# EAGLE design PCB-BI8-2x1RGB (EAGLE 7.5.0)

## Sheet 1 of 2
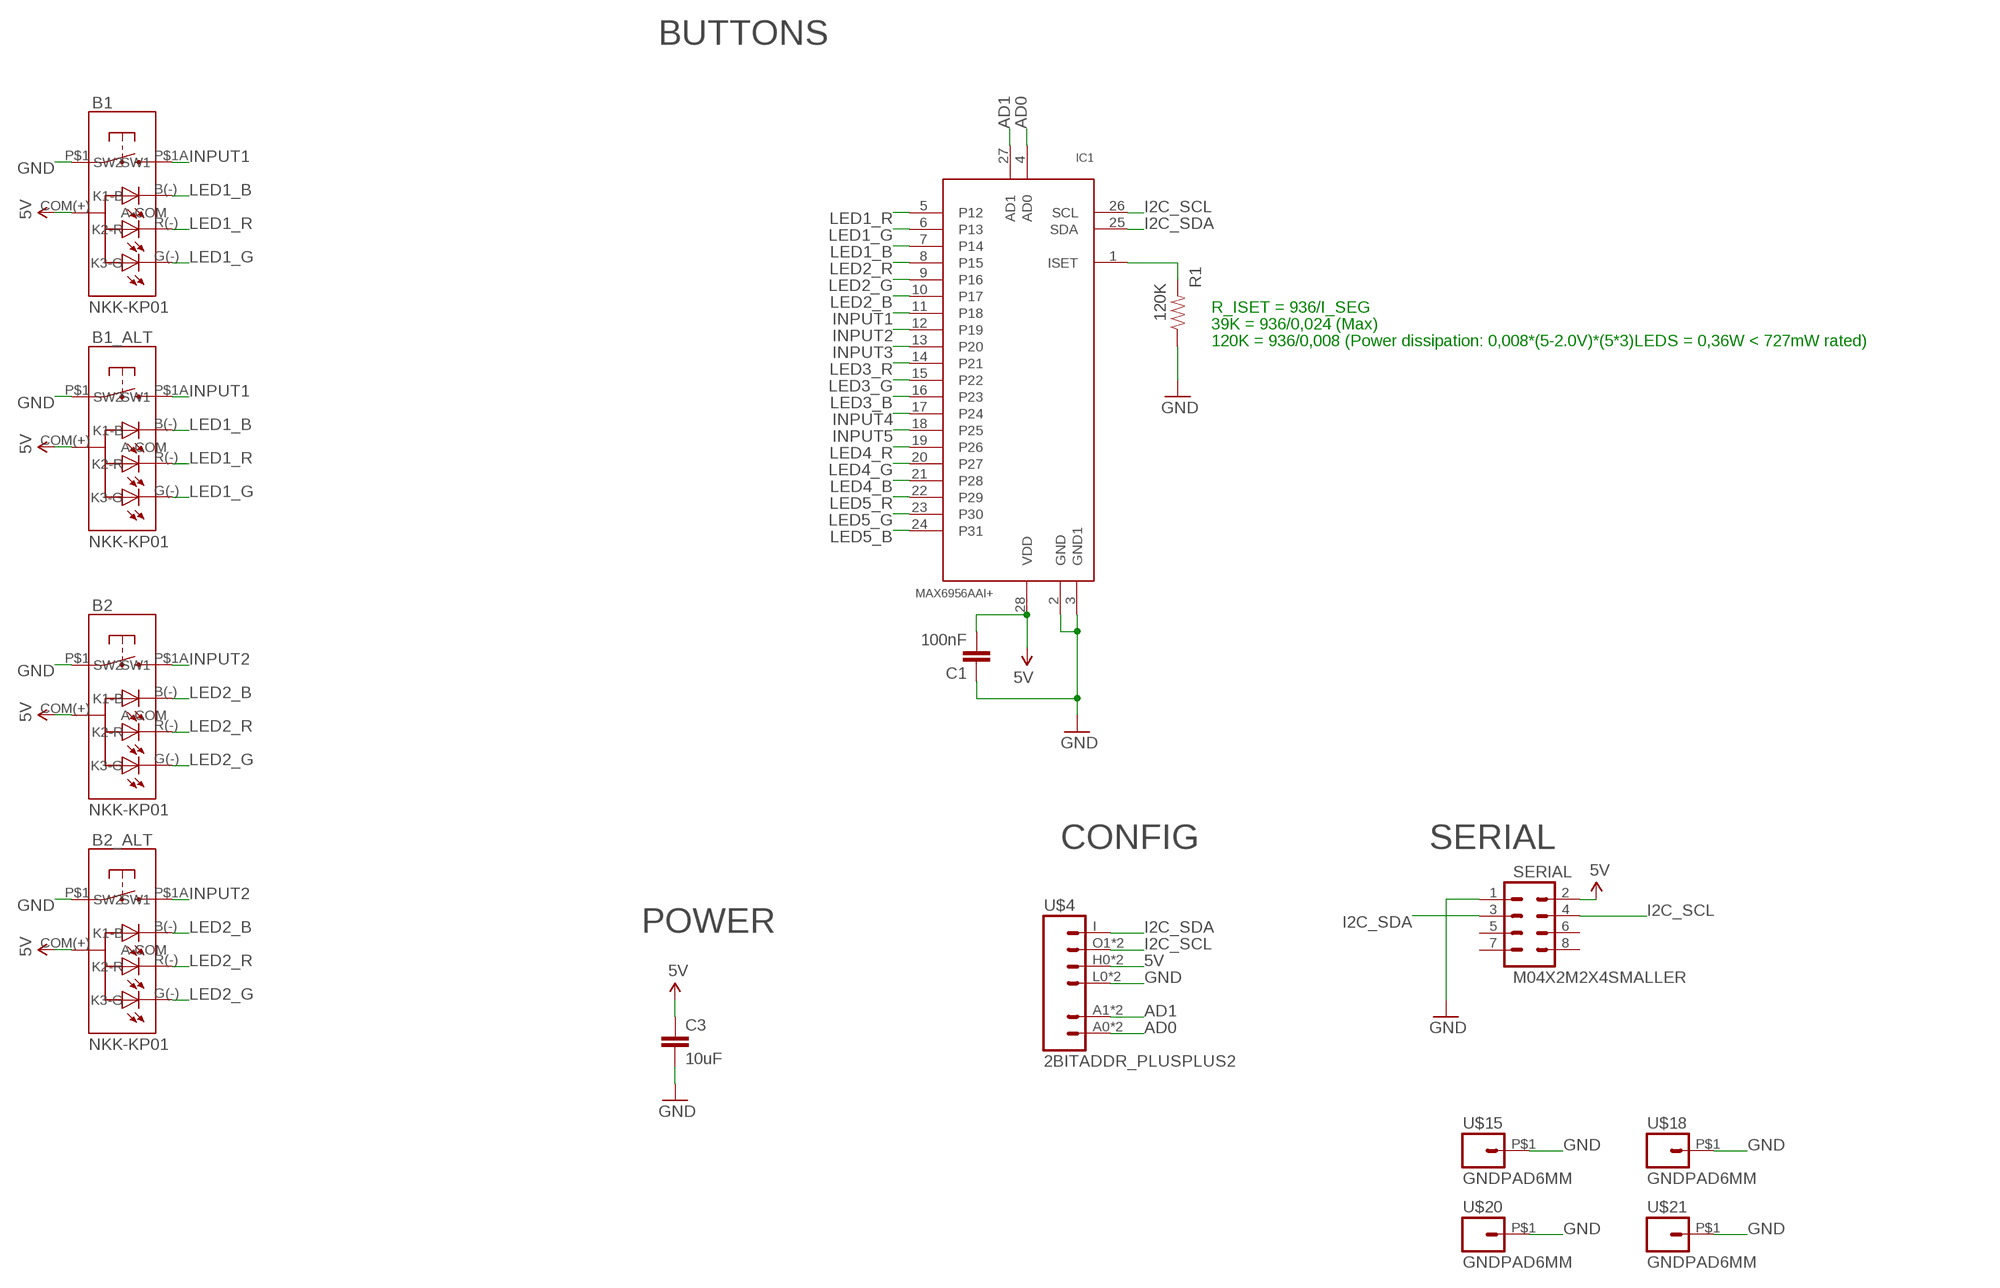
[diagram p0: schematic, sheet 1]

### Parts
B1  NKK-KP01  [NKK-KP01]
B1_ALT  NKK-KP01  [NKK-KP01]
B2  NKK-KP01  [NKK-KP01]
B2_ALT  NKK-KP01  [NKK-KP01]
C1  100nF  CAP0603-CAP  [0603-CAP]
C3  10uF  CAP0805  [0805]
IC1  MAX6956AAI+  [SSOP28]
R1  120K  RESISTOR0603-RES  [0603-RES]
SERIAL  M04X2M2X4SMALLER  [M2X4SMALLER]
U$4  2BITADDR_PLUSPLUS2  [2BITADDR_SMALL_PLUS2]
U$15  GNDPAD6MM  [3.2MMPAD6MM]
U$18  GNDPAD6MM  [3.2MMPAD6MM]
U$20  GNDPAD6MM  [3.2MMPAD6MM]
U$21  GNDPAD6MM  [3.2MMPAD6MM]

### Nets
5V [Power]: B1.COM(+)(A-COM) B1_ALT.COM(+)(A-COM) B2.COM(+)(A-COM) B2_ALT.COM(+)(A-COM) C1.2 C3.1 IC1.28(VDD) SERIAL.2 U$4.H0(VCC) U$4.H1(VCC)
AD0: IC1.4(AD0) U$4.A0(A1) U$4.AS0(A1)
AD1: IC1.27(AD1) U$4.A1(A2) U$4.AS1(A2)
GND [Power]: B1.P$1(SW1) B1_ALT.P$1(SW1) B2.P$1(SW1) B2_ALT.P$1(SW1) C1.1 C3.2 IC1.2(GND) IC1.3(GND1) R1.1 SERIAL.1 U$4.L0(GND) U$4.L1(GND) U$15.P$1 U$18.P$1 U$20.P$1 U$21.P$1
I2C_SCL: IC1.26(SCL) SERIAL.4 U$4.O1 U$4.O2
I2C_SDA: IC1.25(SDA) SERIAL.3 U$4.I
INPUT1: B1.P$1A(SW2) B1_ALT.P$1A(SW2) IC1.11(P18)
INPUT2: B2.P$1A(SW2) B2_ALT.P$1A(SW2) IC1.12(P19)
INPUT3: IC1.13(P20)
INPUT4: IC1.17(P24)
INPUT5: IC1.18(P25)
LED1_B: B1.B(-)(K1-B) B1_ALT.B(-)(K1-B) IC1.7(P14)
LED1_G: B1.G(-)(K3-G) B1_ALT.G(-)(K3-G) IC1.6(P13)
LED1_R: B1.R(-)(K2-R) B1_ALT.R(-)(K2-R) IC1.5(P12)
LED2_B: B2.B(-)(K1-B) B2_ALT.B(-)(K1-B) IC1.10(P17)
LED2_G: B2.G(-)(K3-G) B2_ALT.G(-)(K3-G) IC1.9(P16)
LED2_R: B2.R(-)(K2-R) B2_ALT.R(-)(K2-R) IC1.8(P15)
LED3_B: IC1.16(P23)
LED3_G: IC1.15(P22)
LED3_R: IC1.14(P21)
LED4_B: IC1.21(P28)
LED4_G: IC1.20(P27)
LED4_R: IC1.19(P26)
LED5_B: IC1.24(P31)
LED5_G: IC1.23(P30)
LED5_R: IC1.22(P29)
N$5: IC1.1(ISET) R1.2
Unconnected: SERIAL.5 SERIAL.6 SERIAL.7 SERIAL.8

### Notes on the sheet
- BUTTONS
- R_ISET = 936/I_SEG
- 39K = 936/0,024 (Max)
- 120K = 936/0,008 (Power dissipation: 0,008*(5-2.0V)*(5*3)LEDS = 0,36W < 727mW rated)
- CONFIG | SERIAL
- POWER

## Sheet 2 of 2

## Library data of the parts
B1 B1_ALT B2 B2_ALT = SKAARHOJ:NKK-KP01: NKK-KP01-15AC 100mA12VDC
C1 C3 = SparkFun:CAP: Capacitor Standard 0603 ceramic capacitor, and 0.1" leaded capacitor.
IC1 = SKAARHOJ:MAX6956AAI+
R1 = SparkFun:RESISTOR: Resistor Basic schematic elements and footprints for 0603, 1206, and PTH resistors.
SERIAL = SKAARHOJ:M04X2
U$4 = SKAARHOJ:2BITADDR_PLUS
U$15 U$18 U$20 U$21 = SKAARHOJ:GNDPAD

## Net classes
0 default: width 0.203 mm, drill 0.406 mm, clearance 0.203 mm
1 Power: width 0.406 mm, drill 0.61 mm, clearance 0.254 mm

## Board
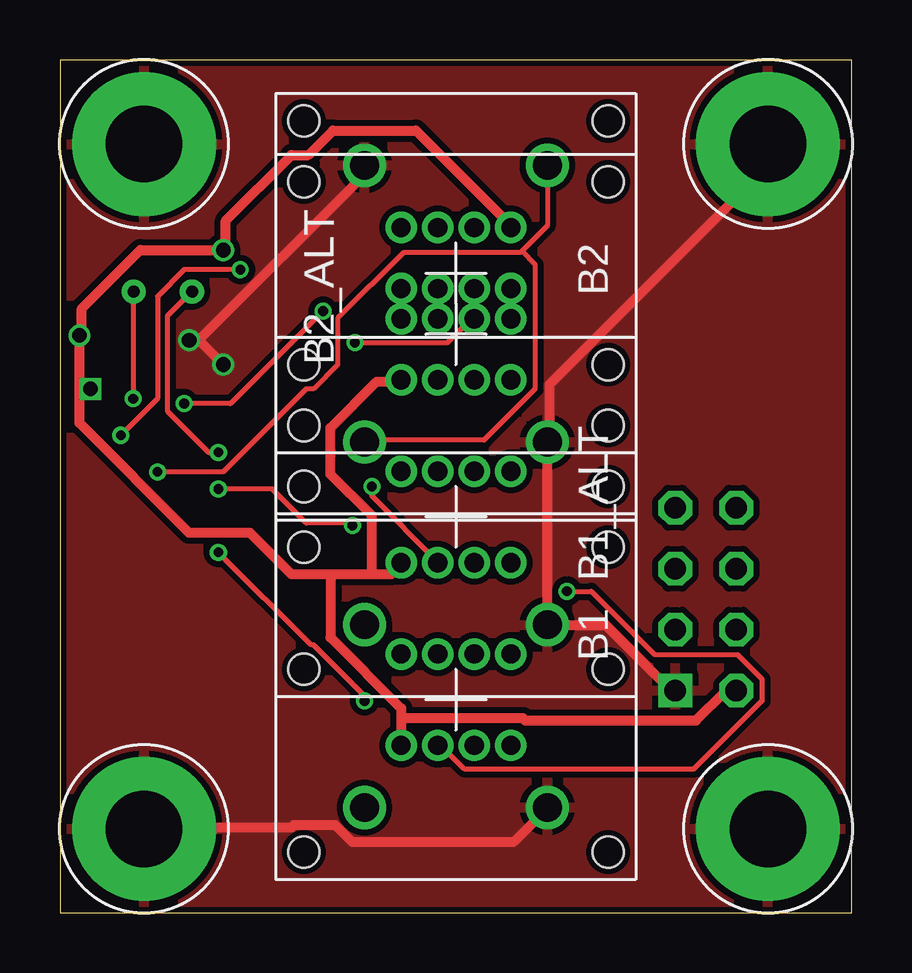
[diagram p1: board, top side]
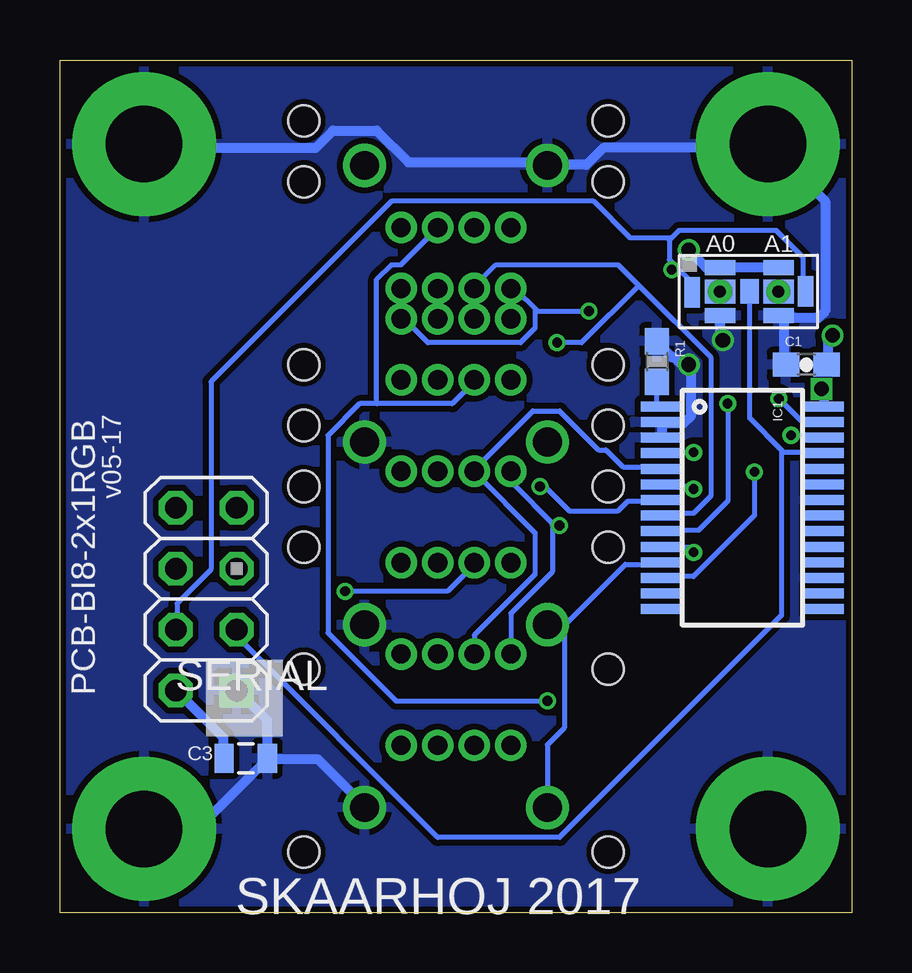
[diagram p2: board, bottom side, seen from below]

Size 33.02 x 35.56 mm. Coordinates in mm from the lower left corner, seen from the top.
Outline: 0,0 33.02,0 33.02,35.56 0,35.56 0,0
Copper layers (1*16): Top 0.035mm / dielectric 1.5mm / Bottom 0.035mm
Design rules "Fusion_eagle_rule_v1.1": minimum track width 6mil, minimum drill 12mil, track to track 6mil, track to pad 6mil, pad to pad 6mil, via to via 6mil, smd to smd 0mil, copper to edge 10mil, drill to drill 10mil, minimum pad ring 10mil, minimum via ring 6mil, stop-mask expansion 2mil, vias tented up to drill 100mil, thermal gap 10mil

### Footprints (pad centres in the part's own frame; a part is rotated, then mirrored left to right if it is on the bottom)
NKK-KP01 = drill 0.8: B(-) 1.905,-0.762; COM(+) 1.905,-2.286; G(-) -1.905,-2.286; P$3 1.905,0.762; P$4 1.905,2.286; P$7 -1.905,0.762; P$8 -1.905,2.286; R(-) -1.905,-0.762 | drill 1.2: P$1 4.496,3.81; P$1A 4.496,-3.81 | hole 1.3: -6.35,6.35; 6.35,6.35; 6.35,-6.35; -6.35,-6.35
0603-CAP = smd 1.1 x 1: 1 -0.85,0; 2 0.85,0
0805 = smd 0.8 x 1.2: 1 -0.9,0; 2 0.9,0
SSOP28 = smd 0.42 x 1.62: 1 -4.225,-3.425; 2 -3.575,-3.425; 3 -2.925,-3.425; 4 -2.275,-3.425; 5 -1.625,-3.425; 6 -0.975,-3.425; 7 -0.325,-3.425; 8 0.325,-3.425; 9 0.975,-3.425; 10 1.625,-3.425; 11 2.275,-3.425; 12 2.925,-3.425; 13 3.575,-3.425; 14 4.225,-3.425; 15 4.225,3.425; 16 3.575,3.425; 17 2.925,3.425; 18 2.275,3.425; 19 1.625,3.425; 20 0.975,3.425; 21 0.325,3.425; 22 -0.325,3.425; 23 -0.975,3.425; 24 -1.625,3.425; 25 -2.275,3.425; 26 -2.925,3.425; 27 -3.575,3.425; 28 -4.225,3.425
0603-RES = smd 1.1 x 1: 1 -0.85,0; 2 0.85,0
M2X4SMALLER = drill 0.9 square: 1 -1.27,3.81 | drill 0.9 octagon: 2 1.27,3.81; 3 -1.27,1.27; 4 1.27,1.27; 5 -1.27,-1.27; 6 1.27,-1.27; 7 -1.27,-3.81; 8 1.27,-3.81
2BITADDR_SMALL_PLUS2 = drill 0.5: A0 -1.565,0; A1 0.87,0 | smd 1.27 x 1: AS0 -1.565,0; AS1 0.87,0 | smd 1.27 x 0.635: H0 -1.565,1; H1 0.87,1; L0 -1.565,-1; L1 0.87,-1 | smd 0.762 x 1.016: I -0.336,0 | smd 0.635 x 1.27: O1 -2.727,-0.041; O2 2.004,0
3.2MMPAD6MM = drill 3.2 pad 6: P$1 0,0

### Placement (x,y rotation side)
B1  16.51,8.89 270 top
B1_ALT  16.51,16.51 270 top
B2  16.51,24.13 270 top
B2_ALT  16.51,26.67 90 top
C1  1.91,22.86 0 bottom
C3  25.27,6.45 0 bottom
IC1  4.57,16.89 270 bottom
R1  8.13,22.99 270 bottom
SERIAL  26.92,13.08 180 bottom
U$4  3.94,25.91 0 bottom
U$15  3.5,3.5 0 top
U$18  29.52,3.5 0 top
U$20  3.5,32.06 0 top
U$21  29.52,32.06 0 top

### Tracks (layer width: path | path; a pad name or v marks a point on that pad's centre or on a via)
5V  (via drill 0.6, 0.61)
  Top 0.406: 0.81,22.1 0.81,20.42 5.38,15.85 7.92,15.85 9.65,14.12 11.28,14.12 | 0.81,22.1 v0.81,24.08 0.91,24.18 0.91,25.2 3.35,27.64 v6.81,27.64 6.91,27.74 6.91,28.85 9.65,31.6 10.36,31.6 11.38,32.61 14.83,32.61 18.8,28.65 B2_ALT.COM(+) | 13.01,14.12 13.82,14.12 14.22,14.53 B1_ALT.COM(+) | 13.01,14.12 11.28,14.12 | 14.22,8.13 14.22,8.53 11.28,11.48 11.28,14.12 | 14.22,8.13 B1.COM(+) | 13.01,14.12 13.01,16.56 11.28,18.29 11.28,20.22 13.21,22.15 14.22,22.15 B2.COM(+) | 14.22,8.13 19.3,8.13 19.41,8.03 26.52,8.03 27.74,9.25 28.14,9.25 SERIAL.2 | v1.27,21.84 0.81,22.1
  Bottom 0.406: C3.1 26.21,6.5 26.21,7.32 28.14,9.25 SERIAL.2 | U$4.H1 3.15,26.92 5.49,26.92 U$4.H0 5.69,26.92 6.1,26.92 v6.81,27.64 | v0.81,24.08 1.02,23.88 1.02,22.86 C1.2 | IC1.28 1.15,21.85 v1.27,21.84
AD0  (via drill 0.41)
  Top 0.203: v6.6,19.2 6.2,19.2 4.47,20.93 4.47,24.89 5.49,25.91 U$4.A0
  Bottom 0.203: 5.49,25.91 U$4.A0 | v6.6,19.2 7.92,19.2 IC1.4
AD1  (via drill 0.41)
  Top 0.203: v3.05,21.44 3.05,25.91 U$4.AS1
  Bottom 0.203: 3.05,25.91 U$4.AS1 | v3.05,21.44 2.13,20.52 1.22,20.52 IC1.27
GND  (via drill 0.61)
  Top 0.406: 5.79,23.88 v5.38,23.88 | 5.79,23.88 12.7,30.79 B2_ALT.P$1 | 5.79,23.88 v6.81,22.86 | SERIAL.1 25.6,9.35 25.4,9.35 22.76,11.99 20.32,11.99 B1_ALT.P$1 B2.P$1 20.42,19.81 20.42,22.05 29.46,31.09 29.46,32 U$21.P$1 | U$15.P$1 3.56,3.56 9.65,3.56 9.75,3.66 11.48,3.66 12.19,2.95 18.9,2.95 20.32,4.37 B1.P$1
  Bottom 0.406: 7.01,22.76 6.71,22.45 6.71,20.73 7.01,20.42 7.92,20.42 | 7.01,22.76 7.42,23.16 7.52,23.16 8.13,23.77 R1.1 | 7.92,20.42 IC1.2 | 7.92,20.42 7.92,19.91 IC1.3 | v5.38,23.88 5.49,23.98 5.49,24.89 U$4.L0 | v6.81,22.86 6.91,22.86 7.01,22.76 | C1.1 2.85,22.86 2.85,24.69 3.05,24.89 U$4.L1 2.74,24.79 1.42,24.79 1.12,25.09 1.12,29.67 3.45,32 U$20.P$1 3.56,31.9 10.36,31.9 11.07,31.19 12.7,31.19 B2_ALT.P$1 12.8,31.29 18.49,31.29 19.81,32.61 21.64,32.61 22.35,31.9 29.36,31.9 U$21.P$1 | C3.2 24.38,6.5 24.38,8.03 25.6,9.25 SERIAL.1 | C3.2 24.18,6.4 22.25,6.4 20.32,4.47 B1.P$1 | C3.2 24.49,6.3 27.23,3.56 29.46,3.56 U$18.P$1
  pour Bottom: 0,0 33.02,0 33.02,35.56 0,35.56
  pour Top: 0,0 33.02,0 33.02,35.56 0,35.56
I2C_SCL  (via drill 0.41)
  Top 0.203: v2.54,19.91 4.06,21.44 4.06,25.7 5.18,26.82 v7.52,26.82
  Bottom 0.203: 7.37,26.98 7.62,27.23 7.62,28.04 7.57,28.09 | 7.37,26.98 6.71,26.31 6.71,25.91 U$4.O1 | 7.57,28.09 7.21,28.45 3.15,28.45 2.03,27.33 2.03,25.91 U$4.O2 | v2.54,19.91 1.22,19.91 IC1.26 | 7.37,26.98 v7.52,26.82 | SERIAL.4 28.14,11.89 28.14,12.9 26.72,14.33 26.72,22.15 19.2,29.67 10.77,29.67 9.25,28.14 7.62,28.14 7.57,28.09
I2C_SDA
  Bottom 0.203: 2.9,19.25 2.85,19.2 1.22,19.2 IC1.25 | 2.9,19.25 4.27,20.62 U$4.I | SERIAL.3 25.6,11.79 25.6,11.48 17.27,3.15 12.19,3.15 2.95,12.39 2.95,19.2 2.9,19.25
INPUT1
  Bottom 0.203: 11.99,12.09 12.7,12.09 B1_ALT.P$1A 11.99,12.09 | 11.99,12.09 11.89,12.09 9.45,14.53 8.03,14.53 IC1.11 | B1.P$1A 12.7,7.01 11.99,7.72 11.99,12.09
INPUT2  (via drill 0.41)
  Top 0.203: v4.06,18.39 6.81,18.39 10.26,21.84 10.57,21.84 11.58,22.86 11.58,24.79 14.33,27.53 19.2,27.53 19.25,27.58 | 19.25,27.58 20.32,28.65 B2_ALT.P$1A | 19.25,27.58 19.81,27.03 19.81,21.84 17.68,19.71 12.7,19.71 B2.P$1A
  Bottom 0.203: v4.06,18.39 4.06,16.56 6.6,14.02 7.92,14.02 IC1.12
LED1_B  (via drill 0.41)
  Top 0.203: v13.01,17.78 13.01,17.37 15.75,14.63 B1_ALT.B(-) | v21.13,13.41 22.15,13.41 24.79,10.77 28.25,10.77 29.26,9.75 29.26,8.84 26.42,5.99 16.87,5.99 15.95,6.91 15.75,6.91 B1.B(-)
  Bottom 0.203: v13.01,17.78 12.8,17.78 11.79,16.76 9.75,16.76 9.35,17.17 8.03,17.17 IC1.7 | v21.13,13.41 16.87,13.41 15.75,14.53 B1_ALT.B(-)
LED1_G  (via drill 0.41)
  Top 0.203: v6.6,17.68 8.84,17.68 10.26,16.26 12.09,16.26 v12.19,16.15
  Bottom 0.203: v6.6,17.68 6.71,17.78 7.92,17.78 IC1.6 | B1_ALT.G(-) 14.22,17.98 12.39,16.15 v12.19,16.15 12.5,16.15 12.5,14.22 14.22,12.5 B1.G(-)
LED1_R
  Bottom 0.203: IC1.5 8.03,18.59 9.55,18.59 10.26,19.3 10.57,19.3 12.19,20.93 13.31,20.93 15.75,18.49 B1_ALT.R(-) 15.75,18.39 13.21,15.85 13.21,14.12 15.75,11.58 B1.R(-)
LED2_B  (via drill 0.41)
  Top 0.203: v6.6,15.04 10.46,11.18 10.57,11.18 12.7,9.04 v12.7,8.84
  Bottom 0.203: v6.6,15.04 6.81,15.24 7.92,15.24 IC1.10 | v12.7,8.84 19,8.84 21.84,11.68 21.84,19.91 20.52,21.23 19.81,21.23 | 19.81,21.23 16.66,21.23 15.75,22.15 B2.B(-) | 19.81,21.23 19.81,26.42 19.2,27.03 18.8,27.03 17.27,28.55 B2_ALT.B(-)
LED2_G  (via drill 0.41)
  Top 0.203: v5.18,21.23 7.11,21.23 v10.97,25.09
  Bottom 0.203: v5.18,21.23 5.18,17.17 6.4,15.95 7.92,15.95 IC1.9 | v10.97,25.09 13.11,25.09 13.16,25.15 | 13.16,25.15 14.02,26.01 14.22,26.01 B2.G(-) | B2_ALT.G(-) 18.8,24.69 18.59,24.69 17.68,23.77 13.82,23.77 13.21,24.38 13.21,25.09 13.16,25.15
LED2_R  (via drill 0.41)
  Top 0.203: v12.29,23.77 16.15,23.77 17.07,24.69 17.27,24.69 B2_ALT.R(-)
  Bottom 0.203: 8.89,26.16 9.75,27.03 14.83,27.03 15.75,26.11 B2.R(-) | 8.89,26.16 5.89,23.16 5.89,17.37 6.6,16.66 7.92,16.66 IC1.8 | v12.29,23.77 11.28,23.77 8.89,26.16
N$5
  Bottom 0.203: R1.2 8.13,21.23 8.03,21.13 IC1.1

### Text on the board
_bsilk: PCB-BI8-2x1RGB | v05-17 | SKAARHOJ 2017